# Altium schematic sheet SIT1533_Oscillator.SchDoc: SIT1533 RTC 32.768 kHz Oscillator
size A4; DocumentNumber: 3; SheetNumber: 3; SheetTotal: 31
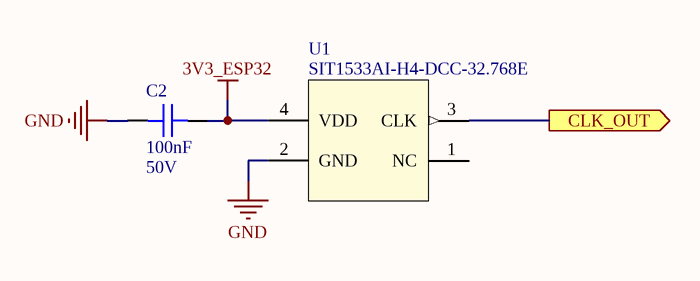
[diagram p0: SIT1533_Oscillator.SchDoc]

## Parts
C2  Capacitance: 100nF  Voltage: 50V  [C0402]  (hidden comment: CAP CER 0.1UF 50V X7R 0402)
U1  Manufacturer Part Number: SIT1533AI-H4-DCC-32.768E  [XTAL4_SiT1533_SIT]  (hidden comment: IC SIT1533AI-H4-DCC-32.768E MEMS OSC XO 32.7680KHZ LVCMOS)

## Ports
CLK_OUT (out)

## Nets
3V3_ESP32: C2.2 U1.4(VDD)
GND: C2.1 U1.2(GND)
CLK_OUT: U1.3(CLK) ; port CLK_OUT

Not connected (* = marked no-connect by the designer): U1 1(NC)

## Notes on the sheet
- Title
- Size:
- Date:
- A4
- Number:
- Time:
- Revision:
- Sheet
- of
- File:

## Library data of the parts
C2 = CAP CER 0.1UF 50V X7R 0402: 0.1µF ±10% 50V Ceramic Capacitor X7R 0402 (1005 Metric); Manufacturer: TDK; Manufacturer Part Number: CGA2B3X7R1H104K050BB; Supplier 1: Digi-Key; Stock 1: 2925303; Pricing 1: 1=0.17, 10=0.118, 50=0.0668, 100=0.0553, 500=0.0388, 1000=0.0321, 2500=0.0299, 5000=0.0273 (USD); Mount: Surface Mount; Case/Package: 0402; Weight: 2.3E-05oz; Case Code (Metric): 1005; Case Code (Imperial): 0402; Min Operating Temperature: -55°C; Max Operating Temperature: 125°C; Voltage Rating: 50V; Tolerance: 10%; Packaging: Tape and Reel; Package Quantity: 1; Voltage Rating (DC): 50V; Dielectric: X7R; Termination: SMD/SMT; Composition: Ceramic; Length: 1mm; Height: 0.5mm; Width: 0.02inch; Thickness: 0.022inch; Depth: 0.5mm; Ratings: AEC-Q200; REACH SVHC: No SVHC; Lead Free: Lead Free; ComponentLink1URL: http://product.tdk.com/capacitor/mlcc/en/documents/mlccspec_automotive_general_midvoltage_en.pdf?src-supplier=Future+Electronics; ComponentLink1Description: http://product.tdk.com/capacitor/mlcc/en/documents/mlccspec_automotive_general_midvoltage_en.pdf?src-supplier=Future+Electronics; ComponentLink2URL: http://www.farnell.com/datasheets/1807242.pdf?src-supplier=Element14; ComponentLink2Description: http://www.farnell.com/datasheets/1807242.pdf?src-supplier=Element14; ComponentLink3URL: http://www.mouser.com/ds/2/400/lcc_automotive_general_en-843974.pdf?src-supplier=Mouser; ComponentLink3Description: http://www.mouser.com/ds/2/400/lcc_automotive_general_en-843974.pdf?src-supplier=Mouser; ComponentLink4URL: http://www.farnell.com/datasheets/1936565.pdf?src-supplier=Element14; ComponentLink4Description: http://www.farnell.com/datasheets/1936565.pdf?src-supplier=Element14; ComponentLink5URL: http://www.farnell.com/datasheets/1735392.pdf?src-supplier=Element14; ComponentLink5Description: http://www.farnell.com/datasheets/1735392.pdf?src-supplier=Element14; Supplier Part Number 1: 445-6899-1-ND; ClassName: MCU
U1 = IC SIT1533AI-H4-DCC-32.768E MEMS OSC XO 32.7680KHZ LVCMOS: 32.768kHz XO (Standard) LVCMOS Oscillator 1.5V ~ 3.63V  4-SMD, No Lead; Manufacturer: SiTime; Frequency Stability: 100ppm; Max Supply Current: 1.4uA; Load Capacitance: 10pF; Current Rating: 1.35uA; Max Duty Cycle: 52%; Supplier 1: Digi-Key; Stock 1: 89278; Pricing 1: 1=1.1, 10=0.975, 50=0.9116, 100=0.8056, 500=0.7632 (USD); Mount: Surface Mount; Case/Package: SMD/SMT; Number of Pins: 4; Min Operating Temperature: -40°C; Max Operating Temperature: 85°C; Packaging: Tape and Reel; Frequency: 32.768kHz; Termination: SMD/SMT; Min Supply Voltage: 1.5V; Max Supply Voltage: 3.63V; Package Quantity: 1000; Length: 0.079inch; Width: 0.047inch; Height: 0.024inch; RoHS Compliant: Yes; ComponentLink1URL: https://www.sitime.com/datasheet/SiT1533?src-supplier=Digi-Key; ComponentLink1Description: https://www.sitime.com/datasheet/SiT1533?src-supplier=Digi-Key; ComponentLink2URL: http://www.mouser.com/ds/2/371/SiT1533-datasheet-275337.pdf?src-supplier=Mouser; ComponentLink2Description: http://www.mouser.com/ds/2/371/SiT1533-datasheet-275337.pdf?src-supplier=Mouser; ComponentLink3URL: http://components.arrow.com/part/dataview/0323_07137603?src-supplier=Arrow+Europe; ComponentLink3Description: http://components.arrow.com/part/dataview/0323_07137603?src-supplier=Arrow+Europe; Supplier Part Number 1: 1473-1239-1-ND; ClassName: MCU